# EAGLE design ws2811 (EAGLE 9.1.1)
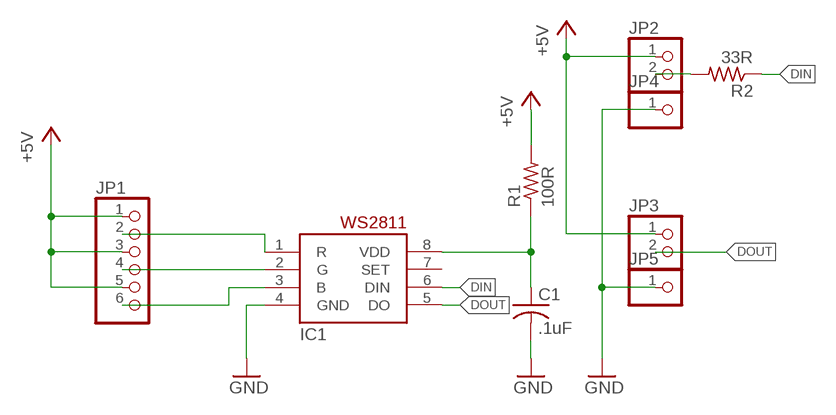
[diagram p0: schematic, sheet 1]

## Parts
C1  .1uF  C-USC0402  [C0402]
IC1  WS2811-SOP8  [SO08-SKINNYPADS]
JP1  PINHD-1X6  [1X06]
JP2  PINHD-1X2  [1X02]
JP3  PINHD-1X2  [1X02]
JP4  PINHD-1X1  [1X01]
JP5  PINHD-1X1  [1X01]
R1  100R  R-US_R0402  [R0402]
R2  33R  R-US_R0402  [R0402]

## Nets
+5V [power]: JP1.1 JP1.3 JP1.5 JP2.1 JP3.1 R1.2
DIN: IC1.6(DIN) R2.1
DOUT: IC1.5(DO) JP3.2
GND [power]: C1.2 IC1.4(GND) JP4.1 JP5.1
N$1: C1.1 IC1.8(VDD) R1.1
N$2: JP2.2 R2.2
N$3: IC1.1(R) JP1.2
N$4: IC1.2(G) JP1.4
N$5: IC1.3(B) JP1.6
Unconnected: IC1.7(SET)

## Library data of the parts
C1 = rcl:C-US: CAPACITOR, American symbol; SPICEPREFIX: C
IC1 = adafruit:WS2811
JP1 = pinhead-smallpad:PINHD-1X6: PIN HEADER
JP2 JP3 = pinhead-smallpad:PINHD-1X2: PIN HEADER
JP4 JP5 = pinhead-smallpad:PINHD-1X1: PIN HEADER
R1 R2 = rcl:R-US_: RESISTOR, American symbol; SPICEPREFIX: R

## Net classes
0 default: width 0.305 mm, drill 0.305 mm, clearance 0.254 mm
1 power: width 0.406 mm, drill 0.406 mm, clearance 0.254 mm

## Board
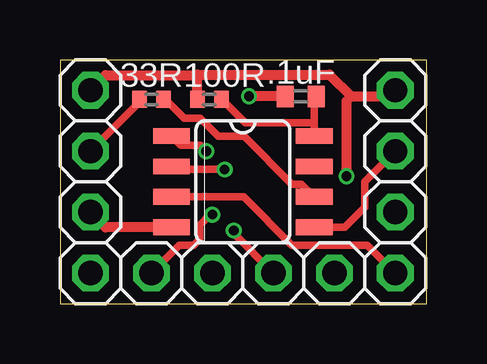
[diagram p1: board, top side]
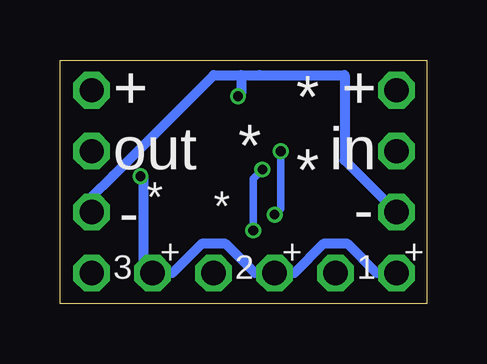
[diagram p2: board, bottom side, seen from below]

Size 15.29 x 10.15 mm. Coordinates in mm from the lower left corner, seen from the top.
Outline: 0,0 15.29,0 15.29,10.15 0,10.15 0,0
Copper layers (1*16): Top 0.035559375mm / dielectric 1.6mm / Bottom 0.035559375mm
Design rules "oshpark-2layer *": minimum track width 6mil, minimum drill 10mil, track to track 6mil, track to pad 6mil, pad to pad 6mil, via to via 6mil, smd to smd 6mil, copper to edge 15mil, drill to drill 6mil, minimum pad ring 5mil, minimum via ring 5mil, stop-mask expansion 2.5mil, vias tented up to drill 12mil, thermal gap 10mil

### Footprints (pad centres in the part's own frame; a part is rotated, then mirrored left to right if it is on the bottom)
C0402 = smd 0.7 x 0.9: 1 -0.65,0; 2 0.65,0
SO08-SKINNYPADS = smd 0.66 x 1.524: 1 -1.905,-2.973; 2 -0.635,-2.973; 3 0.635,-2.973; 4 1.905,-2.973; 5 1.905,2.973; 6 0.635,2.973; 7 -0.635,2.973; 8 -1.905,2.973
1X06 = drill 1.016 octagon: 1 -6.35,0; 2 -3.81,0; 3 -1.27,0; 4 1.27,0; 5 3.81,0; 6 6.35,0
1X02 = drill 1.016 octagon: 1 -1.27,0; 2 1.27,0
1X01 = drill 1.016 octagon: 1 0,0
R0402 = smd 0.6 x 0.7: 1 -0.5,0; 2 0.5,0

### Placement (x,y rotation side)
C1  10.03,8.64 180 top
IC1  7.62,5.08 270 top
JP1  7.62,1.27 0 top
JP2  1.27,7.62 270 top
JP3  13.97,7.62 270 top
JP4  1.27,3.81 0 top
JP5  13.97,3.81 0 top
R1  6.22,8.51 180 top
R2  3.81,8.51 180 top

### Tracks (layer width: path | path; a pad name or v marks a point on that pad's centre or on a via)
+5V  (via drill 0.41)
  Top 0.406: JP3.1 13.72,8.64 12.13,8.64 | 12.13,8.64 11.22,9.54 5.72,9.54 | v11.94,5.31 11.94,8.44 12.13,8.64 | JP2.1 1.91,9.53 5.71,9.53 5.72,9.54 | R1.2 5.72,9.54
  Bottom 0.406: JP1.1 2.09,1.27 3.31,2.49 4.32,2.49 5.53,1.27 JP1.3 7.17,1.27 8.38,2.49 9.39,2.49 10.61,1.27 JP1.5 11.81,1.65 11.81,5.18 v11.94,5.31
DIN
  Top 0.305: IC1.6 10.06,4.98 9.66,4.98 7.67,6.97 6.6,6.97 5.85,7.72 5.18,7.72 4.39,8.51 R2.1
DOUT
  Top 0.305: JP3.2 12.7,5.08 12.7,4.01 11.86,3.17 IC1.5
GND  (via drill 0.41)
  Top 0.406: C1.2 v7.87,8.64 | IC1.4 1.91,3.17 JP4.1
  Bottom 0.406: 7.75,9.53 8.89,9.53 13.08,5.33 13.97,4.45 JP5.1 | 7.75,9.53 6.99,9.53 3.43,9.53 3.43,5.97 JP4.1 | 7.75,9.53 7.75,8.76 v7.87,8.64
N$1
  Top 0.305: IC1.8 10.59,7.53 | 10.59,7.53 7.72,7.53 6.74,8.51 R1.1 | C1.1 10.59,8.55 10.59,7.53
N$2
  Top 0.305: JP2.2 3.31,8.39 R2.2
N$3  (via drill 0.41)
  Top 0.305: v6.35,3.71 6.25,3.71 5.82,3.27 5.82,2.68 5.58,2.44 4.98,2.44 JP1.2 | IC1.1 5.03,6.6 5.84,6.6 v6.1,6.35
  Bottom 0.305: v6.35,3.71 6.1,3.96 v6.1,6.35
N$4  (via drill 0.41)
  Top 0.305: JP1.4 7.24,2.92 v7.24,3.05 | v6.86,5.59 4.77,5.59 IC1.2
  Bottom 0.305: v7.24,3.05 7.24,5.21 v6.86,5.59
N$5
  Top 0.305: JP1.6 12.8,2.44 9.66,2.44 7.66,4.45 IC1.3

### Text on the board
tNames: 33R | 100R | .1uF
bNames: + | * | + | in | * | out | * | * | - | * | - | + | + | + | 1 | 2 | 3